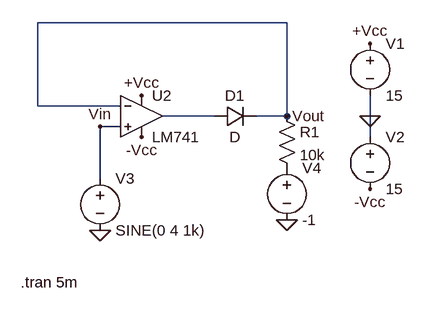
[diagram p0: schematic Schematic.asc]
Schematic.asc, the LTspice schematic file:
Version 4
SHEET 1 880 680
WIRE 432 0 48 0
WIRE 48 128 48 0
WIRE 176 128 48 128
WIRE 320 144 240 144
WIRE 432 144 432 0
WIRE 432 144 384 144
WIRE 560 144 560 112
WIRE 176 160 144 160
WIRE 560 176 560 144
WIRE 144 240 144 160
FLAG 560 144 0
FLAG 560 32 +Vcc
FLAG 560 256 -Vcc
FLAG 144 320 0
FLAG 208 112 +Vcc
FLAG 208 176 -Vcc
FLAG 432 304 0
FLAG 432 144 Vout
FLAG 144 160 Vin
SYMBOL voltage 560 16 R0
WINDOW 123 0 0 Left 0
WINDOW 39 0 0 Left 0
SYMATTR InstName V1
SYMATTR Value 15
SYMBOL voltage 560 160 R0
WINDOW 123 0 0 Left 0
WINDOW 39 0 0 Left 0
SYMATTR InstName V2
SYMATTR Value 15
SYMBOL voltage 144 224 R0
WINDOW 123 0 0 Left 0
WINDOW 39 0 0 Left 0
SYMATTR InstName V3
SYMATTR Value SINE(0 4 1k)
SYMBOL OpAmps\\LM741 208 80 R0
SYMATTR InstName U2
SYMBOL diode 320 128 M90
WINDOW 0 0 32 VBottom 2
WINDOW 3 32 32 VTop 2
SYMATTR InstName D1
SYMBOL res 416 128 R0
SYMATTR InstName R1
SYMATTR Value 10k
SYMBOL voltage 432 208 R0
WINDOW 123 0 0 Left 0
WINDOW 39 0 0 Left 0
SYMATTR InstName V4
SYMATTR Value -1
TEXT 22 400 Left 2 !.tran 5m

The netlist it stands for:
* Schematic.asc
V1 +Vcc 0 15
V2 0 -Vcc 15
V3 Vin 0 SINE(0 4 1k)
XU2 Vin Vout +Vcc -Vcc N001 LM741  ; pins In+ In- V+ V- OUT
D1 N001 Vout D
R1 Vout P001 10k
V4 P001 0 -1
.model D D
.lib standard.dio
.tran 5m
.lib LM741.lib
.backanno
.end